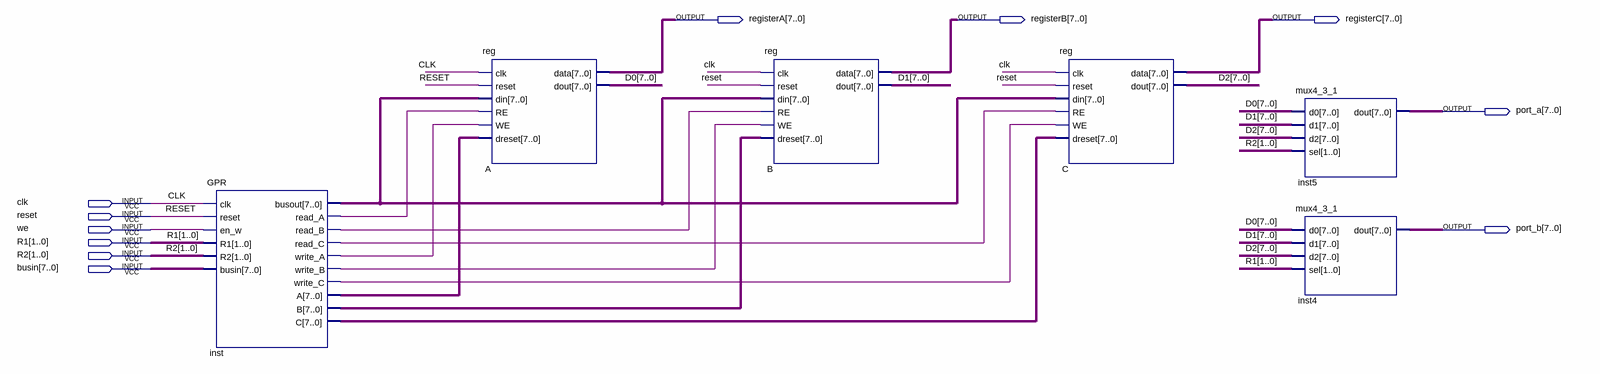
[diagram p0: schematic sheet]
// Quartus schematic GPR_group.bdf as structural Verilog: 6 symbols, 11 pins
module GPR_group (
  input  clk,
  input  reset,
  input  we,
  input  [1:0] R1,
  input  [1:0] R2,
  input  [7:0] busin,
  output [7:0] registerA,
  output [7:0] registerB,
  output [7:0] registerC,
  output [7:0] port_a,
  output [7:0] port_b
);

  wire inst_read_a, inst_read_b, inst_read_c, inst_write_a, inst_write_b, inst_write_c;
  wire [7:0] D0, D1, D2, inst_a, inst_b, inst_busout, inst_c;

  GPR inst (
    .clk(clk), .reset(reset), .en_w(we), .R1(R1), .R2(R2), .busin(busin), .busout(inst_busout),
    .read_A(inst_read_a), .read_B(inst_read_b), .read_C(inst_read_c), .write_A(inst_write_a),
    .write_B(inst_write_b), .write_C(inst_write_c), .A(inst_a), .B(inst_b), .C(inst_c));
  \reg  A (
    .clk(clk), .reset(reset), .din(inst_busout), .RE(inst_read_a), .WE(inst_write_a), .dreset(inst_a),
    .data(registerA), .dout(D0));
  \reg  B (
    .clk(clk), .reset(reset), .din(inst_busout), .RE(inst_read_b), .WE(inst_write_b), .dreset(inst_b),
    .data(registerB), .dout(D1));
  \reg  C (
    .clk(clk), .reset(reset), .din(inst_busout), .RE(inst_read_c), .WE(inst_write_c), .dreset(inst_c),
    .data(registerC), .dout(D2));
  mux4_3_1 inst5 (.d0(D0), .d1(D1), .d2(D2), .sel(R2), .dout(port_a));
  mux4_3_1 inst4 (.d0(D0), .d1(D1), .d2(D2), .sel(R1), .dout(port_b));
endmodule
